# Altium schematic sheet Pmaster-A9112-remote_1.SchDoc
size A3; SheetNumber: 0; SheetTotal: 0
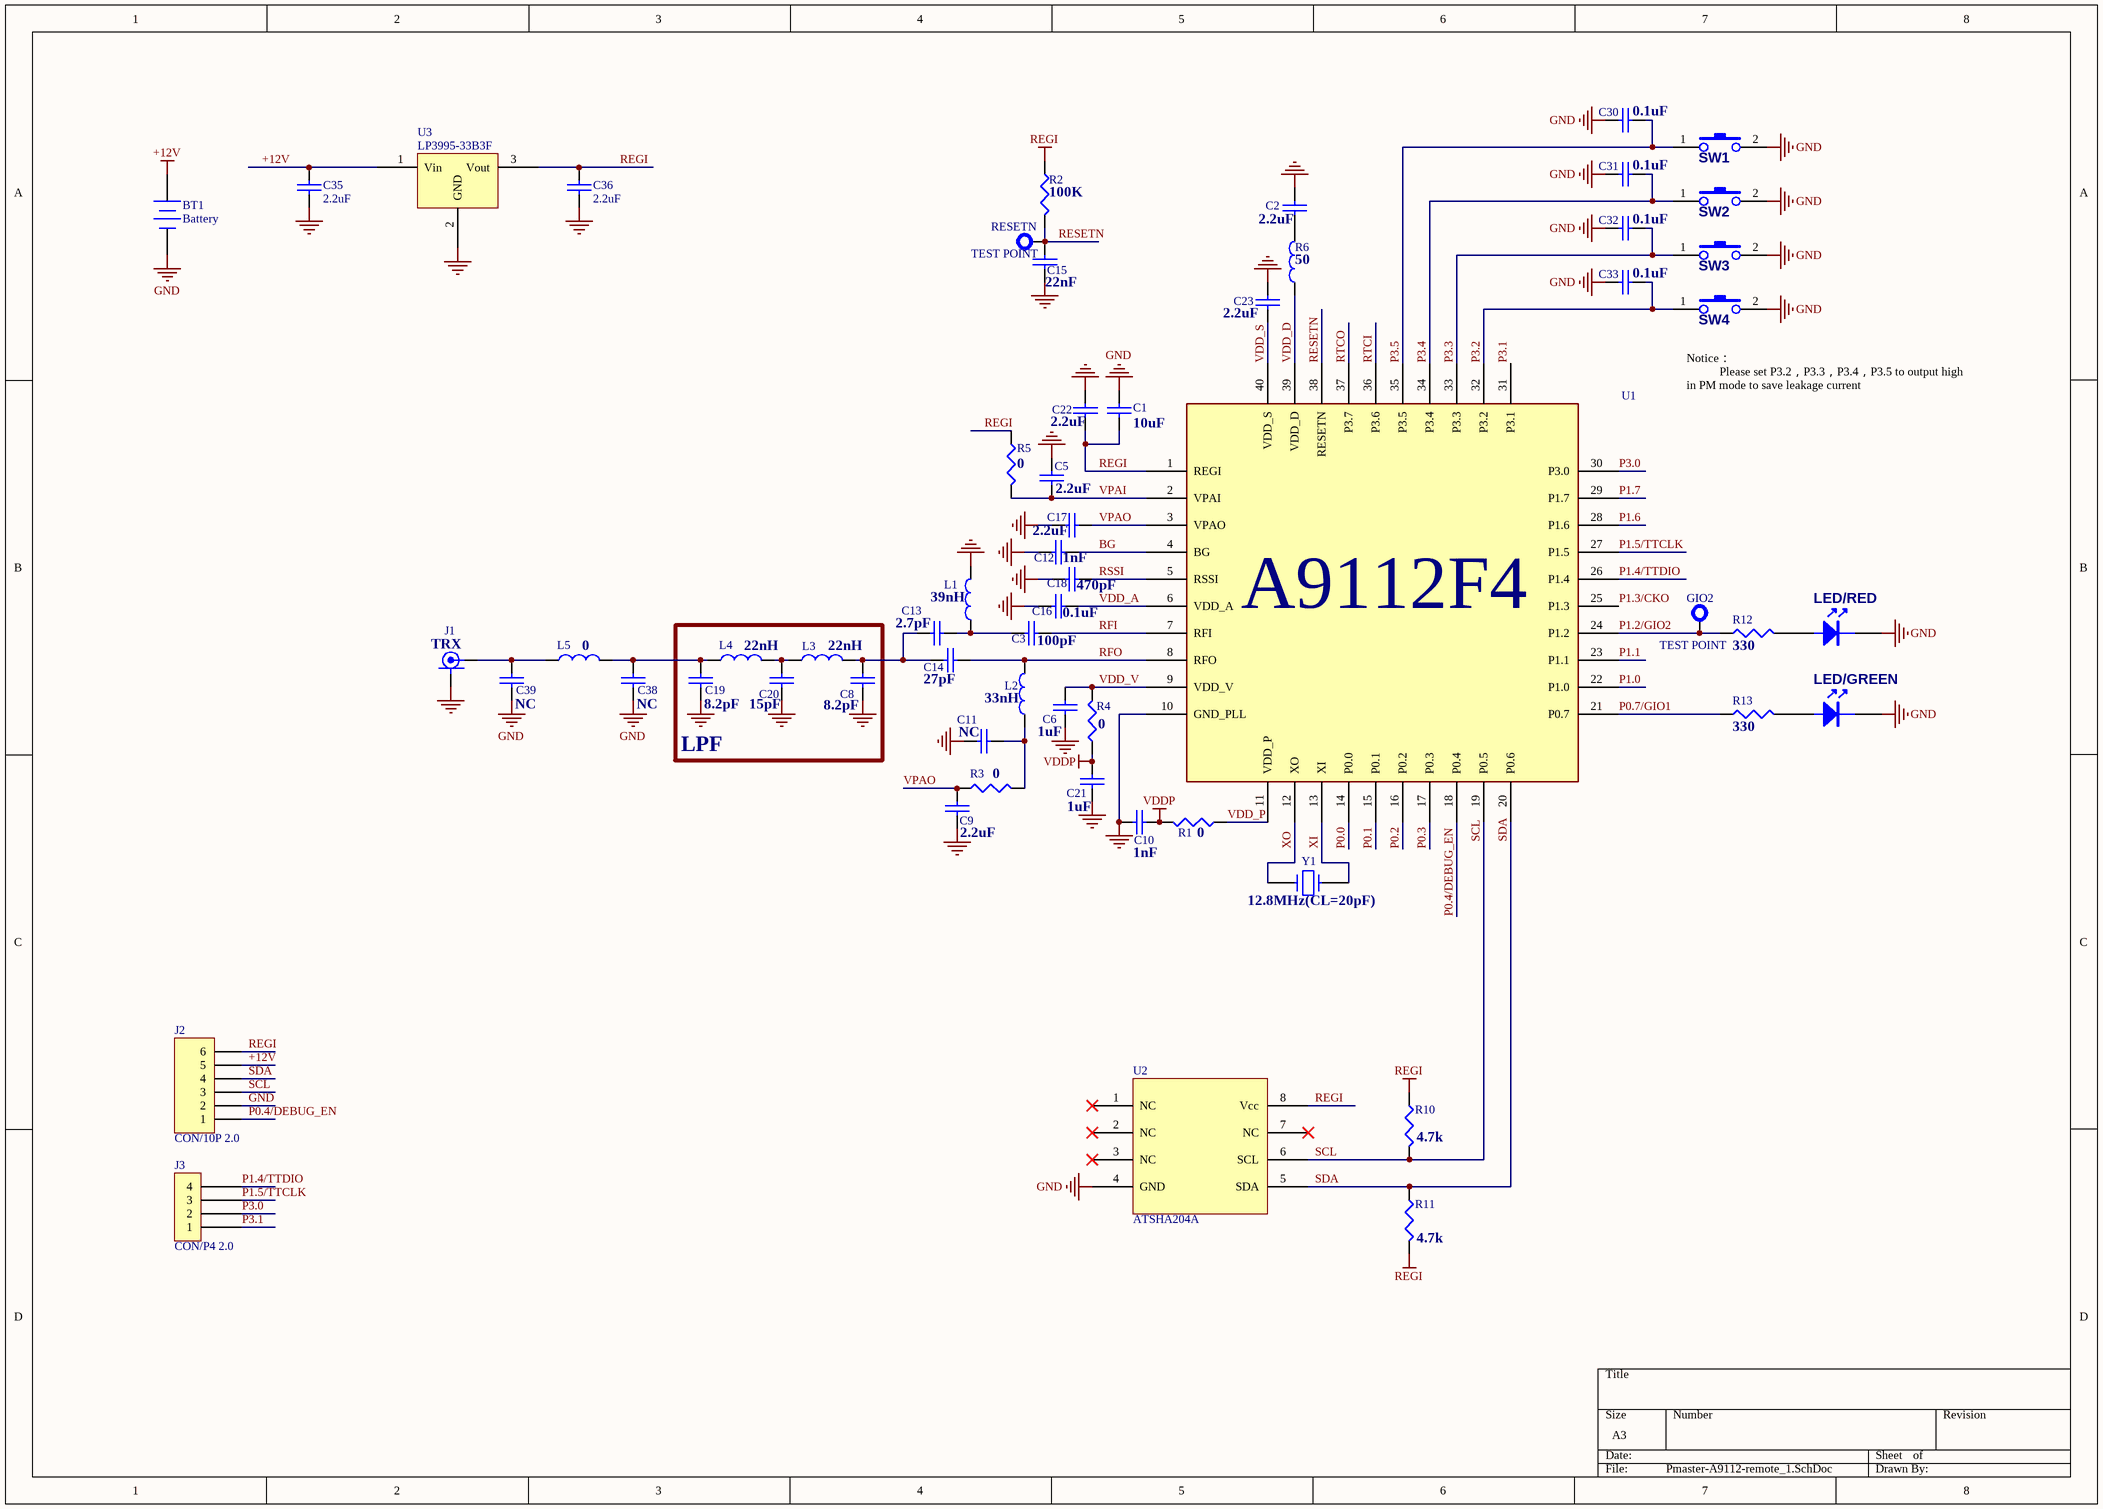
[diagram p0: Pmaster-A9112-remote_1.SchDoc]

## Parts
BT1  Battery  [BAT-2]
C1  10uF  [1206]
C2  2.2uF  [0603]
C3  100pF  [0402]
C5  2.2uF  [0603]
C6  1uF  [0603]
C8  8.2pF  [0402]
C9  2.2uF  [0603]
C10  1nF  [0402]
C11  NC  [0402]
C12  1nF  [0402]
C13  2.7pF  [0402]
C14  27pF  [0402]
C15  22nF  [0402]
C16  0.1uF  [0603]
C17  2.2uF  [0603]
C18  470pF  [0402]
C19  8.2pF  [0402]
C20  15pF  [0402]
C21  1uF  [0402]
C22  2.2uF  [0603]
C23  2.2uF  [0603]
C30  0.1uF  [0603]
C31  0.1uF  [0603]
C32  0.1uF  [0603]
C33  0.1uF  [0603]
C35  2.2uF  [0603]
C36  2.2uF  [0603]
C38  NC  [0402]
C39  NC  [0402]
GIO2  TEST POINT  [DIPOLE]
J1  TRX  [SMA CONNECTOR]
J2  CON/10P 2.0  [HDR10_2.0]
J3  CON/P4 2.0
L1  39nH  [0402]
L2  33nH  [0402]
L3  22nH  [0402]
L4  22nH  [0402]
L5  0  [0402]
LED/GREEN  LED/GREEN  [0603]  (value not drawn)
LED/RED  LED/RED  [0603]  (value not drawn)
R1  0  [0402]
R2  100K  [0402]
R3  0  [0402]
R4  0  [0402]
R5  0  [0402]
R6  50  [0402]
R10  4.7k  [0402]
R11  4.7k  [0402]
R12  330  [0402]
R13  330  [0402]
RESETN  TEST POINT  [DIPOLE]
SW1  SW-PB\2P  [SW2P]  (value not drawn)
SW2  SW-PB\2P  [SW2P]  (value not drawn)
SW3  SW-PB\2P  [SW2P]  (value not drawn)
SW4  SW-PB\2P  [SW2P]  (value not drawn)
U1  A9112F4  [QFN 5*5 40L]
U2  ATSHA204A
U3  LP3995-33B3F  [SOT-223]
Y1  12.8MHz(CL=20pF)  [XTAL1]

## Blocks framed on the sheet
LPF: C8 C19 C20 L3 L4

## Nets
+12V: BT1.1(+) C35.2 J2.5 U3.1(Vin)
GND: BT1.2(-) C1.2 C2.1 C5.2 C8.1 C9.2 C10.1 C11.1 C12.2 C15.2 C16.1 C17.2 C18.1 C19.2 C20.2 C21.1 C22.1 C23.1 C30.1 C31.1 C32.1 C33.1 C35.1 C36.2 C38.2 C39.2 J1.0(SHIELD) J2.2 L1.2 LED/GREEN.2(K) LED/RED.2(K) SW1.2 SW2.2 SW3.2 SW4.2 U1.10(GND_PLL) U2.4(GND) U3.2(GND)
REGI: C1.1 C22.2 C36.1 J2.6 R2.1 R5.1 R10.1 R11.2 U1.1(REGI) U2.8(Vcc) U3.3(Vout)
VCO_GND: C6.2
VDDP: C10.2 C21.2 R1.2 R4.1
BG: C12.1 U1.4(BG)
P0.0: U1.14(P0.0)
P0.1: U1.15(P0.1)
P0.2: U1.16(P0.2)
P0.3: U1.17(P0.3)
P0.4/DEBUG_EN: J2.1 U1.18(P0.4)
P0.7/GIO1: R13.1 U1.21(P0.7)
P1.0: U1.22(P1.0)
P1.1: U1.23(P1.1)
P1.2/GIO2: GIO2.1 R12.1 U1.24(P1.2)
P1.3/CKO: U1.25(P1.3)
P1.4/TTDIO: J3.4 U1.26(P1.4)
P1.5/TTCLK: J3.3 U1.27(P1.5)
P1.6: U1.28(P1.6)
P1.7: U1.29(P1.7)
P3.0: J3.2 U1.30(P3.0)
P3.1: J3.1 U1.31(P3.1)
P3.2: C33.2 SW4.1 U1.32(P3.2)
P3.3: C32.2 SW3.1 U1.33(P3.3)
P3.4: C31.2 SW2.1 U1.34(P3.4)
P3.5: C30.2 SW1.1 U1.35(P3.5)
RESETN: C15.1 R2.2 RESETN.1 U1.38(RESETN)
RFI: C3.1 U1.7(RFI)
RFO: C14.1 L2.2 U1.8(RFO)
RSSI: C18.2 U1.5(RSSI)
RTCI: U1.36(P3.6)
RTCO: U1.37(P3.7)
SCL: J2.3 R10.2 U1.19(P0.5) U2.6(SCL)
SDA: J2.4 R11.1 U1.20(P0.6) U2.5(SDA)
VDD_A: C16.2 U1.6(VDD_A)
VDD_D: R6.1 U1.39(VDD_D)
VDD_P: R1.1 U1.11(VDD_P)
VDD_S: C23.2 U1.40(VDD_S)
VDD_V: C6.1 R4.2 U1.9(VDD_V)
VPAI: C5.1 R5.2 U1.2(VPAI)
VPAO: C9.1 C17.1 R3.1 U1.3(VPAO)
XI: U1.13(XI) Y1.1
XO: U1.12(XO) Y1.2
NetC2_2: C2.2 R6.2
NetC3_2: C3.2 C13.1 L1.1
NetC8_2: C8.2 C13.2 C14.2 L3.2
NetC11_2: C11.2 L2.1 R3.2
NetC19_1: C19.1 C38.1 L4.1 L5.2
NetC20_1: C20.1 L3.1 L4.2
NetC39_1: C39.1 J1.1(CENTER_1) L5.1
NetLED/GREEN_1: LED/GREEN.1(A) R13.2
NetLED/RED_1: LED/RED.1(A) R12.2

Not connected (* = marked no-connect by the designer): U2 1(NC)* 2(NC)* 3(NC)* 7(NC)*

## Notes on the sheet
- (near SW4) Notice：
  Please set P3.2，P3.3，P3.4，P3.5 to output high in PM mode to save leakage current

## Library data of the parts
BT1 = Battery: Multicell Battery; Published: 24-Mar-1999; LatestRevisionDate: 17-Jul-2002; LatestRevisionNote: Re-released for DXP Platform.; PackageReference: BAT-2; Publisher: Altium Limited; PackageDescription: Battery; 2 Leads
C1-C3 C5 C6 C8 C10 C12-C14 C16 C18 C21-C23 C30-C33 C35 = CAP
C9 C11 C17 C19 C20 C36 C38 C39 = C/0603: Chip C
C15 = C/1206: Chip C
GIO2 RESETN = TP
J1 = SMA CONNECTOR
J2 = CON/6P 2.0: Hole 36mil
J3 = CON/P4 2.54
L1 L2 = L/0402: Chip L
L3-L5 R6 = L/0603
LED/GREEN LED/RED = LED
R1 R5 R10-R13 = RES1
R2 = R/0402: Chip R
R3 R4 = R/0603: Chip  R
U3 = REG\G903\3.3V\SOT-223: GMT 3.3V REGULTOR
Y1 = CRYSTAL